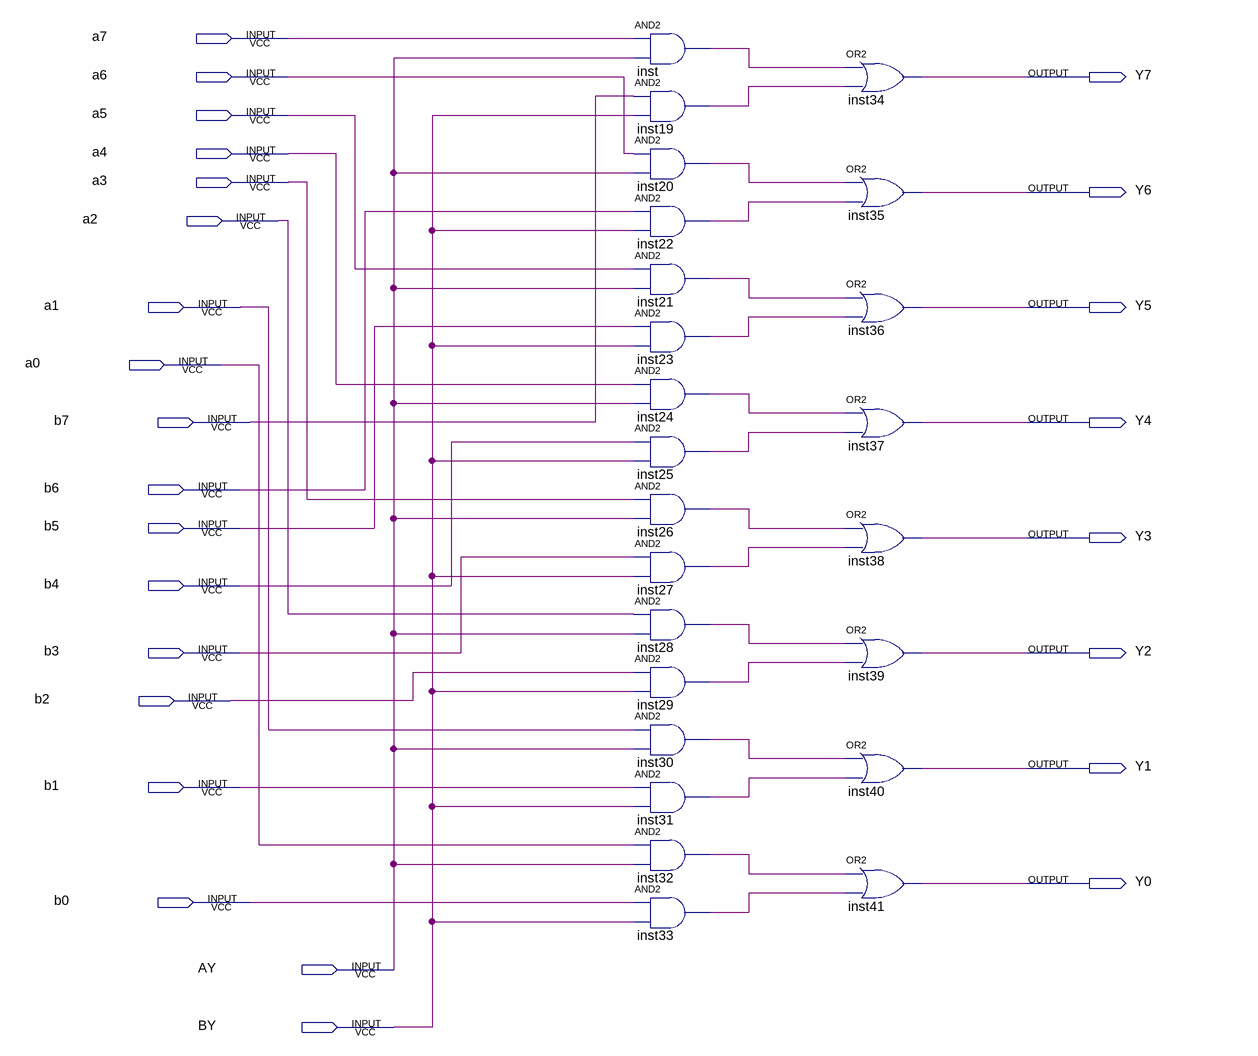
[diagram p0: schematic sheet]
// Quartus schematic selector.bdf as structural Verilog: 24 symbols, 26 pins
module selector (
  input  a7,
  input  a6,
  input  a5,
  input  a4,
  input  a3,
  input  a2,
  input  a1,
  input  a0,
  input  b7,
  input  b6,
  input  b5,
  input  b4,
  input  b3,
  input  b2,
  input  b1,
  input  b0,
  input  AY,
  input  BY,
  output Y7,
  output Y6,
  output Y5,
  output Y4,
  output Y3,
  output Y2,
  output Y1,
  output Y0
);

  wire inst19_out, inst20_out, inst21_out, inst22_out, inst23_out, inst24_out, inst25_out, inst26_out,
       inst27_out, inst28_out, inst29_out, inst30_out, inst31_out, inst32_out, inst33_out, inst_out;

  and inst (inst_out, a7, AY);
  and inst19 (inst19_out, b7, BY);
  and inst20 (inst20_out, a6, AY);
  and inst22 (inst22_out, b6, BY);
  and inst21 (inst21_out, a5, AY);
  and inst23 (inst23_out, b5, BY);
  and inst24 (inst24_out, a4, AY);
  and inst25 (inst25_out, b4, BY);
  and inst26 (inst26_out, a3, AY);
  and inst27 (inst27_out, b3, BY);
  and inst28 (inst28_out, a2, AY);
  and inst29 (inst29_out, b2, BY);
  and inst30 (inst30_out, a1, AY);
  and inst31 (inst31_out, b1, BY);
  and inst32 (inst32_out, a0, AY);
  and inst33 (inst33_out, b0, BY);
  or inst34 (Y7, inst_out, inst19_out);
  or inst35 (Y6, inst20_out, inst22_out);
  or inst36 (Y5, inst21_out, inst23_out);
  or inst37 (Y4, inst24_out, inst25_out);
  or inst38 (Y3, inst26_out, inst27_out);
  or inst39 (Y2, inst28_out, inst29_out);
  or inst40 (Y1, inst30_out, inst31_out);
  or inst41 (Y0, inst32_out, inst33_out);
endmodule
